# Altium project demo0920.PrjPCB
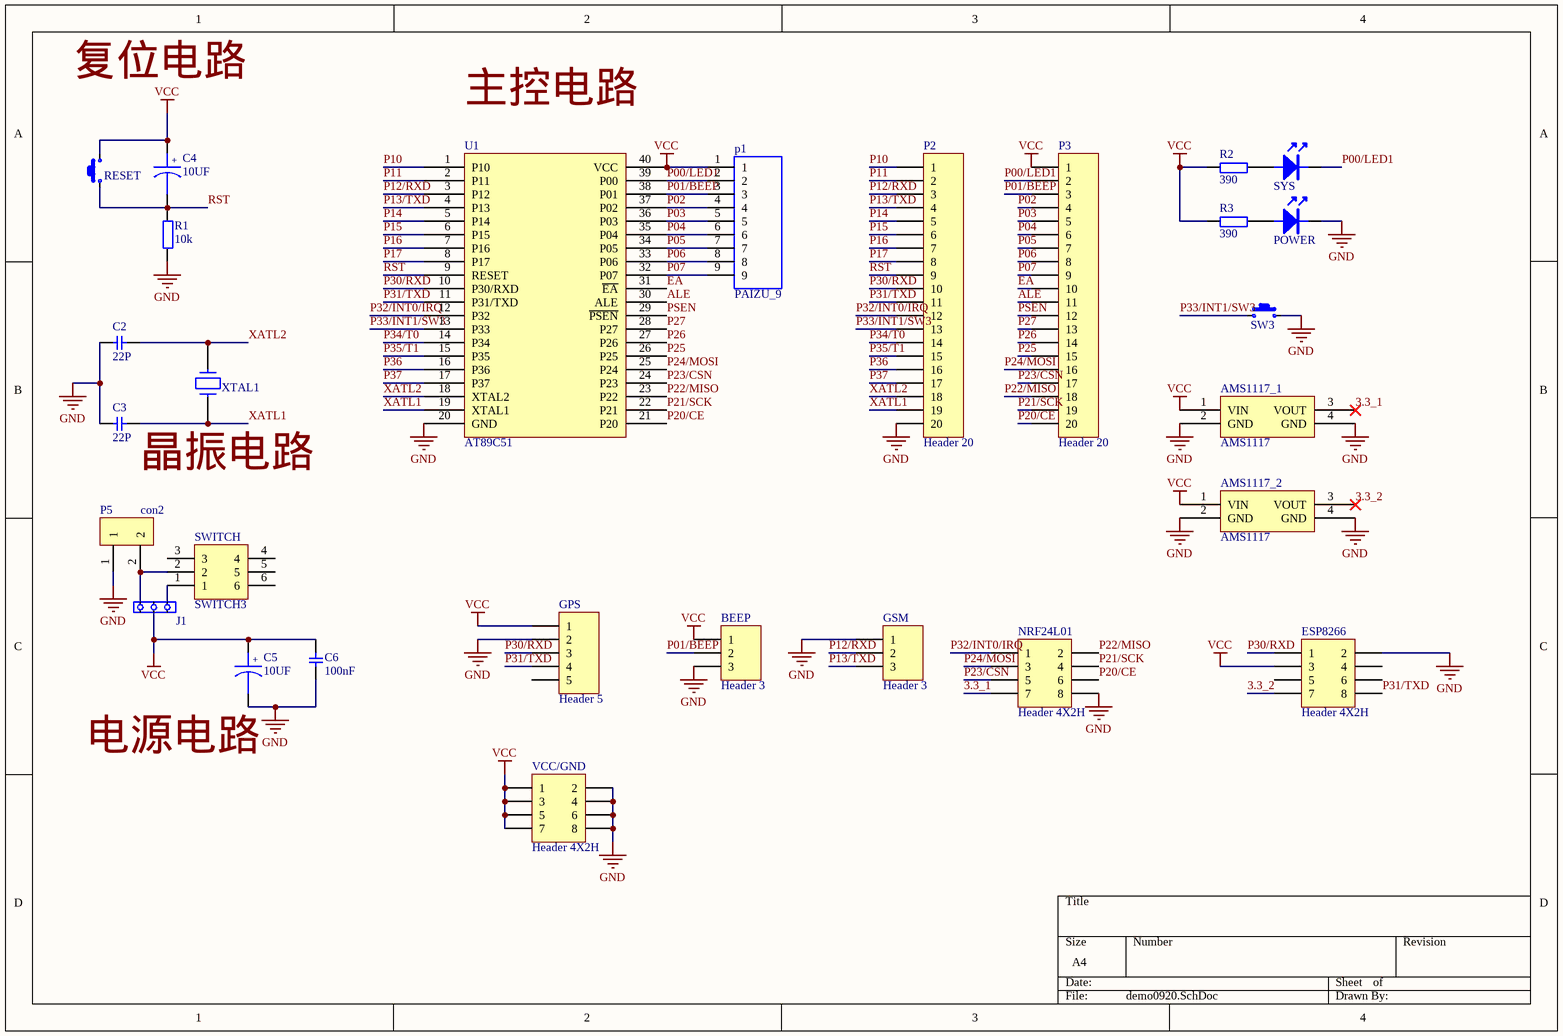
[diagram p0: demo0920.SchDoc]
1 sheet, 28 parts. Net scope: global (net labels, ports and power ports of the same name join across sheets).
Board file: SafeCar.PcbDoc

## Sheet demo0920.SchDoc
size A4

### Parts
AMS1117_1  AMS1117  [AMS1117]
AMS1117_2  AMS1117  [AMS1117]
BEEP  Header 3  [HDR1X3]
C2  22  [0805C]  (value not drawn)
C3  22  [0805C]  (value not drawn)
C4  CAPD  [RB470U]  (value not drawn)
C5  CAPD  [RB470U]  (value not drawn)
C6  22  [0805C]  (value not drawn)
ESP8266  Header 4X2H  [HDR2X4H]
GPS  Header 5  [HDR1X5]
GSM  Header 3  [HDR1X3]
J1  Select  [CON3]  (value not drawn)
NRF24L01  Header 4X2H  [HDR2X4H]
p1  PAIZU_9  [PAIZU_9]
P2  Header 20  [HDR1X20]
P3  Header 20  [HDR1X20]
P5  con2  [CON2]
POWER  LED  [0805-LED]  (value not drawn)
R1  10k  [0805]
R2  390  [0805]
R3  390  [0805]
RESET  SW  [SWD]  (value not drawn)
SW3  SW  [SWD]  (value not drawn)
SWITCH  SWITCH3  [SWITCH3]
SYS  LED  [0805-LED]  (value not drawn)
U1  AT89C51  [DIP40紧锁座]
VCC/GND  Header 4X2H  [HDR2X4H]
XTAL1  CRYSTAL  [XTAL]  (value not drawn)

### Nets
GND: AMS1117_1.2(GND) AMS1117_1.4(GND) AMS1117_2.2(GND) AMS1117_2.4(GND) BEEP.3 C2.1 C3.1 C5.2 C6.1 ESP8266.2 GPS.2 GSM.1 NRF24L01.8 P2.20 P5.1 POWER.2 R1.1 SW3.2 U1.20(GND) VCC/GND.2 VCC/GND.4 VCC/GND.6 VCC/GND.8
VCC: AMS1117_1.1(VIN) AMS1117_2.1(VIN) BEEP.1 C4.1 C5.1 C6.2 ESP8266.3 GPS.1 J1.2 p1.1 P3.1 R2.1 R3.1 RESET.2 U1.40(VCC) VCC/GND.1 VCC/GND.3 VCC/GND.5 VCC/GND.7
3.3_1: AMS1117_1.3(VOUT) NRF24L01.7
3.3_2: AMS1117_2.3(VOUT) ESP8266.7
ALE: P3.11 U1.30(ALE)
EA: P3.10 U1.31(~{EA})
P00/LED1: p1.2 P3.2 SYS.2 U1.39(P00)
P01/BEEP: BEEP.2 p1.3 P3.3 U1.38(P01)
P02: p1.4 P3.4 U1.37(P02)
P03: p1.5 P3.5 U1.36(P03)
P04: p1.6 P3.6 U1.35(P04)
P05: p1.7 P3.7 U1.34(P05)
P06: p1.8 P3.8 U1.33(P06)
P07: p1.9 P3.9 U1.32(P07)
P10: P2.1 U1.1(P10)
P11: P2.2 U1.2(P11)
P12/RXD: GSM.2 P2.3 U1.3(P12)
P13/TXD: GSM.3 P2.4 U1.4(P13)
P14: P2.5 U1.5(P14)
P15: P2.6 U1.6(P15)
P16: P2.7 U1.7(P16)
P17: P2.8 U1.8(P17)
P20/CE: NRF24L01.6 P3.20 U1.21(P20)
P21/SCK: NRF24L01.4 P3.19 U1.22(P21)
P22/MISO: NRF24L01.2 P3.18 U1.23(P22)
P23/CSN: NRF24L01.5 P3.17 U1.24(P23)
P24/MOSI: NRF24L01.3 P3.16 U1.25(P24)
P25: P3.15 U1.26(P25)
P26: P3.14 U1.27(P26)
P27: P3.13 U1.28(P27)
P30/RXD: ESP8266.1 GPS.3 P2.10 U1.10(P30/RXD)
P31/TXD: ESP8266.8 GPS.4 P2.11 U1.11(P31/TXD)
P32/INT0/IRQ: NRF24L01.1 P2.12 U1.12(P32)
P33/INT1/SW3: P2.13 SW3.1 U1.13(P33)
P34/T0: P2.14 U1.14(P34)
P35/T1: P2.15 U1.15(P35)
P36: P2.16 U1.16(P36)
P37: P2.17 U1.17(P37)
PSEN: P3.12 U1.29(~{PSEN})
RST: C4.2 P2.9 R1.2 RESET.1 U1.9(RESET)
XATL1: C3.2 P2.19 U1.19(XTAL1) XTAL1.1
XATL2: C2.2 P2.18 U1.18(XTAL2) XTAL1.2
NetJ1_1: J1.1 SWITCH.1
NetJ1_3: J1.3 P5.2 SWITCH.2
NetPOWER_1: POWER.1 R3.2
NetR2_2: R2.2 SYS.1

Not connected (* = marked no-connect by the designer): ESP8266 4 5 6; GPS 5; SWITCH 3 4 5 6

### Notes on the sheet
- 复位电路
- 主控电路
- (near C3) 晶振电路
- 电源电路
- (in symbol CAP) 22P; 100nF
- (in symbol CAPD) +; 10UF

### Library data of the parts
BEEP GSM = Header 3: Header, 3-Pin; LatestRevisionDate: 17-Jul-2002; LatestRevisionNote: Re-released for DXP Platform.; Publisher: Altium Limited
C2 C3 C6 = CAP: C
ESP8266 NRF24L01 VCC/GND = Header 4X2H: Header, 4-Pin, Dual row, Right Angle; LatestRevisionDate: 17-Jul-2002; LatestRevisionNote: Re-released for DXP Platform.; Publisher: Altium Limited
GPS = Header 5: Header, 5-Pin; LatestRevisionDate: 17-Jul-2002; LatestRevisionNote: Re-released for DXP Platform.; Publisher: Altium Limited
J1 = JUMP3
P2 P3 = Header 20: Header, 20-Pin; LatestRevisionDate: 17-Jul-2002; LatestRevisionNote: Re-released for DXP Platform.; Publisher: Altium Limited
R1-R3 = R1: R?